# Altium schematic sheet DDR_Memory.SchDoc
size 420 x 297 mm; DrawnBy: Santiago Rodriguez; Revision: V1; SheetNumber: 6; SheetTotal: 9
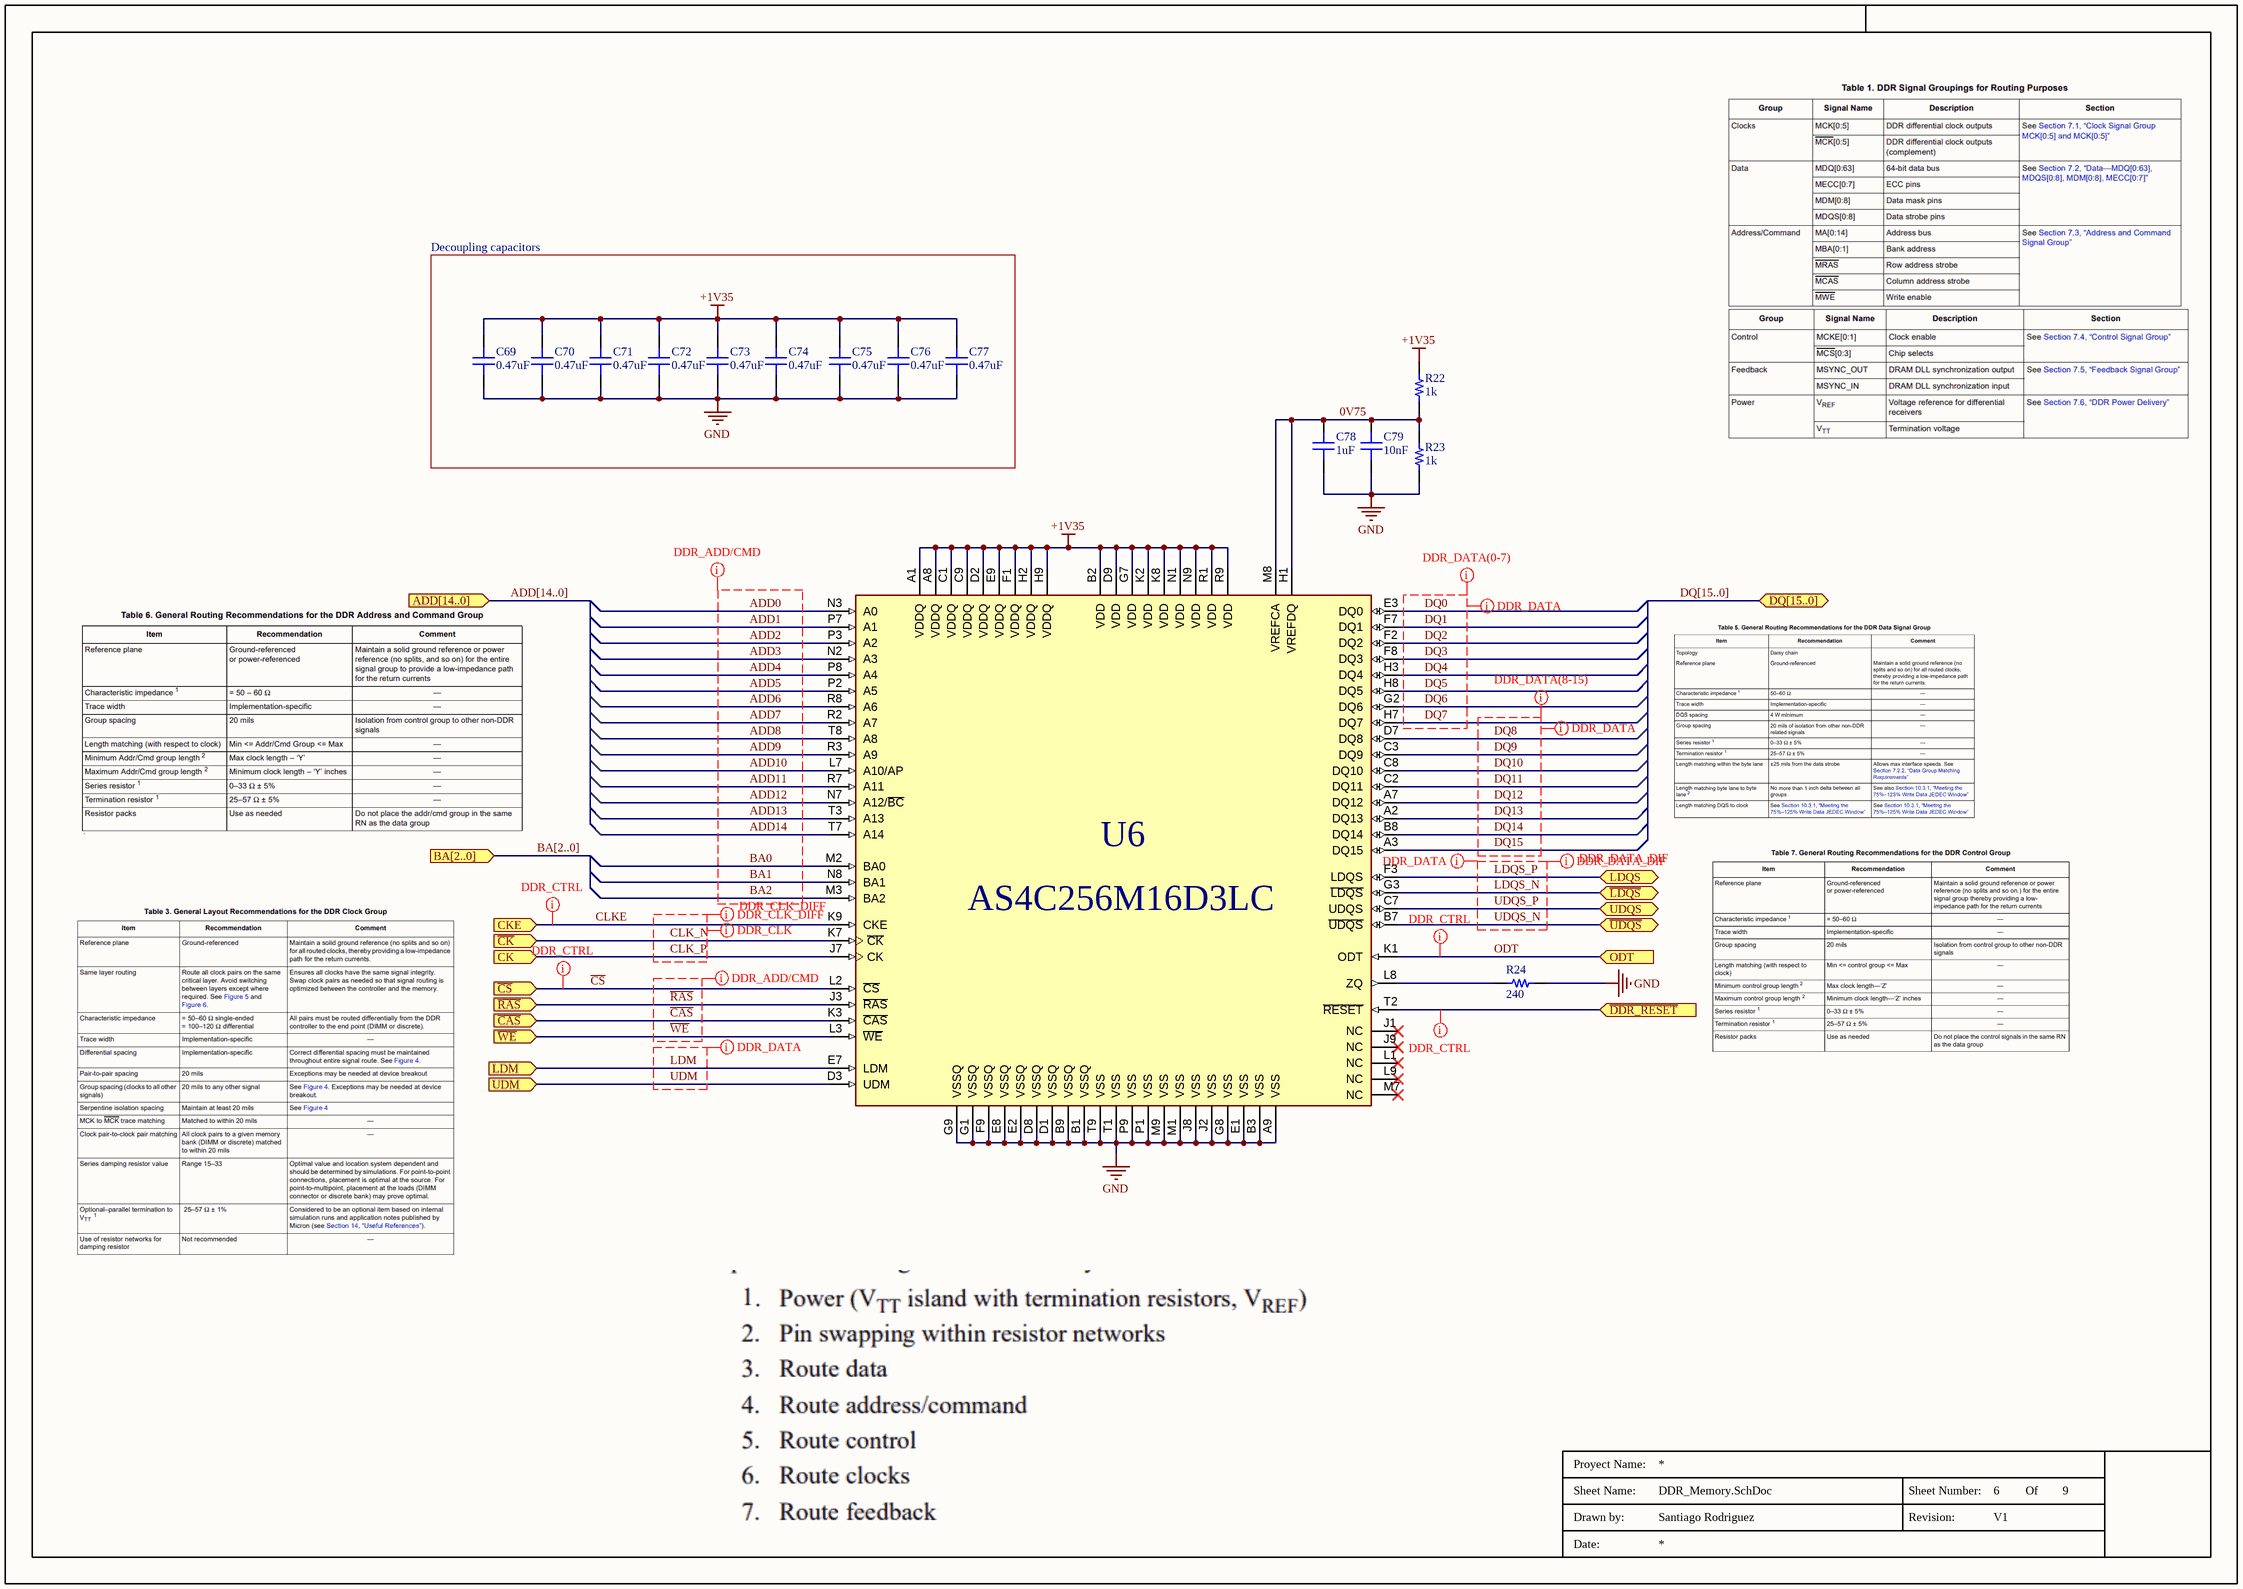
[diagram p0: DDR_Memory.SchDoc]

## Parts
C69  0.47uF  [CAP0402]
C70  0.47uF  [CAP0402]
C71  0.47uF  [CAP0402]
C72  0.47uF  [CAP0402]
C73  0.47uF  [CAP0402]
C74  0.47uF  [CAP0402]
C75  0.47uF  [CAP0402]
C76  0.47uF  [CAP0402]
C77  0.47uF  [CAP0402]
C78  1uF  [CAP0402]
C79  10nF  [CAP0402]
R22  1k  [RES0402]
R23  1k  [RES0402]
R24  240  [RES0402]
U6  AS4C256M16D3LC  [FBGA-96]

## Blocks framed on the sheet
Decoupling capacitors: C69-C77

## Ports
ADD[14..0] (in), BA[2..0] (in), CK (in), CKE (in), DQ[15..0] (bidir), LDM (in), LDQS (bidir), ODT (in), UDM (in), UDQS (bidir), ~{CAS} (in), ~{CK} (in), ~{CS} (in), ~{DDR_RESET} (in), ~{LDQS} (bidir), ~{RAS} (in), ~{UDQS} (bidir), ~{WE} (in)

## Nets
+1V35: C69.2 C70.2 C71.2 C72.2 C73.2 C74.2 C75.2 C76.2 C77.2 R22.2 U6.A1(VDDQ) U6.A8(VDDQ) U6.B2(VDD) U6.C1(VDDQ) U6.C9(VDDQ) U6.D2(VDDQ) U6.D9(VDD) U6.E9(VDDQ) U6.F1(VDDQ) U6.G7(VDD) U6.H2(VDDQ) U6.H9(VDDQ) U6.K2(VDD) U6.K8(VDD) U6.N1(VDD) U6.N9(VDD) U6.R1(VDD) U6.R9(VDD)
GND: C69.1 C70.1 C71.1 C72.1 C73.1 C74.1 C75.1 C76.1 C77.1 C78.1 C79.1 R23.1 R24.2 U6.A9(VSS) U6.B1(VSSQ) U6.B3(VSS) U6.B9(VSSQ) U6.D1(VSSQ) U6.D8(VSSQ) U6.E1(VSS) U6.E2(VSSQ) U6.E8(VSSQ) U6.F9(VSSQ) U6.G1(VSSQ) U6.G8(VSS) U6.G9(VSSQ) U6.J2(VSS) U6.J8(VSS) U6.M1(VSS) U6.M9(VSS) U6.P1(VSS) U6.P9(VSS) U6.T1(VSS) U6.T9(VSS)
0V75: C78.2 C79.2 R22.1 R23.2 U6.H1(VREFDQ) U6.M8(VREFCA)
ADD0: U6.N3(A0)
ADD1: U6.P7(A1)
ADD2: U6.P3(A2)
ADD3: U6.N2(A3)
ADD4: U6.P8(A4)
ADD5: U6.P2(A5)
ADD6: U6.R8(A6)
ADD7: U6.R2(A7)
ADD8: U6.T8(A8)
ADD9: U6.R3(A9)
ADD10: U6.L7(A10/AP)
ADD11: U6.R7(A11)
ADD12: U6.N7(A12/~{BC})
ADD13: U6.T3(A13)
ADD14: U6.T7(A14)
BA0: U6.M2(BA0)
BA1: U6.N8(BA1)
BA2: U6.M3(BA2)
~{CAS}: U6.K3(~{CAS}) ; port ~{CAS}
~{CS}: U6.L2(~{CS}) ; port ~{CS}
CLK_N: U6.K7(~{CK}) ; port ~{CK}
CLK_P: U6.J7(CK) ; port CK
CLKE: U6.K9(CKE) ; port CKE
~{DDR_RESET}: U6.T2(~{RESET}) ; port ~{DDR_RESET}
DQ0: U6.E3(DQ0)
DQ1: U6.F7(DQ1)
DQ2: U6.F2(DQ2)
DQ3: U6.F8(DQ3)
DQ4: U6.H3(DQ4)
DQ5: U6.H8(DQ5)
DQ6: U6.G2(DQ6)
DQ7: U6.H7(DQ7)
DQ8: U6.D7(DQ8)
DQ9: U6.C3(DQ9)
DQ10: U6.C8(DQ10)
DQ11: U6.C2(DQ11)
DQ12: U6.A7(DQ12)
DQ13: U6.A2(DQ13)
DQ14: U6.B8(DQ14)
DQ15: U6.A3(DQ15)
LDM: U6.E7(LDM) ; port LDM
LDQS_N: U6.G3(~{LDQS}) ; port ~{LDQS}
LDQS_P: U6.F3(LDQS) ; port LDQS
ODT: U6.K1(ODT) ; port ODT
~{RAS}: U6.J3(~{RAS}) ; port ~{RAS}
UDM: U6.D3(UDM) ; port UDM
UDQS_N: U6.B7(~{UDQS}) ; port ~{UDQS}
UDQS_P: U6.C7(UDQS) ; port UDQS
~{WE}: U6.L3(~{WE}) ; port ~{WE}
NetR24_1: R24.1 U6.L8(ZQ)

Not connected (* = marked no-connect by the designer): U6 J1(NC)* J9(NC)* L1(NC)* L9(NC)* M7(NC)*

## Buses and harness runs
bus ADD[14..0] = port ADD[14..0]
bus BA[2..0] = port BA[2..0]
bus DQ[15..0] = port DQ[15..0]

## Layout directives
net class DDR_ADD/CMD: ADD0, ADD1, ADD2, ADD3, ADD4, ADD5, ADD6, ADD7, ADD8, ADD9, ADD10, ADD11, ADD12, ADD13, ADD14, BA0, BA1, BA2, ~{CAS}, ~{RAS}, ~{WE}
differential pair; differential pair class DDR_CLK_DIFF: CLK_N, CLK_P
net class DDR_CTRL: CLKE, ODT, ~{CS}, ~{DDR_RESET}
differential pair; differential pair class DDR_DATA_DIF: LDQS_N, LDQS_P, UDQS_N, UDQS_P
net class DDR_DATA(8-15): DQ8, DQ9, DQ10, DQ11, DQ12, DQ13, DQ14, DQ15
net class DDR_DATA(0-7): DQ0, DQ1, DQ2, DQ3, DQ4, DQ5, DQ6, DQ7
net class DDR_CLK: CLK_N, CLK_P
net class DDR_DATA: DQ0, DQ1, DQ2, DQ3, DQ4, DQ5, DQ6, DQ7, DQ8, DQ9, DQ10, DQ11, DQ12, DQ13, DQ14, DQ15, LDM, LDQS_N, LDQS_P, UDM, UDQS_N, UDQS_P

## Notes on the sheet
- Proyect Name:
- Sheet Name:
- Drawn by:
- Revision:
- Sheet Number:
- Of
- Date:

## Library data of the parts
C69-C77 = C0402C474K8RAC: CAP CER 0.47uF 10V X7R 0402 10%; PartNumber: C0603C474K4RAC; Manufacturer: Kemet; ComponentLink1Description: DataSheet; ComponentLink1URL: https://content.kemet.com/datasheets/KEM_C1002_X7R_SMD.pdf; Size: 0402; ComponentLink2Description: DigiKey; ComponentLink2URL: https://www.digikey.com/en/products/filter/ceramic-capacitors/60?s=N4IgTCBcDaIMIAYAsCxyQdiQaQBwCUBBOEAXQF8g; ComponentLink3Description: ProductPage; ComponentLink3URL: https://www.kemet.com/en/us/product/C0805C474K4RACTU.html; Tolerance: 10%; Value: 0.47uF; Voltage: 10 V
C78 = C0402C105K4RAC: CAP CER 1uF 16V X7R 0402 10%; Manufacturer: Kemet; ComponentLink1Description: DataSheet; ComponentLink1URL: https://content.kemet.com/datasheets/KEM_C1002_X7R_SMD.pdf; Size: 0402; ComponentLink2Description: DigiKey; ComponentLink2URL: https://www.digikey.com/en/products/detail/kemet/C0402C105K4RAC7867/22058709?s=N4IgTCBcDaIMIAYAsCxwIwIKwGkkCUBBOEAXQF8g; Value: 1uF; Tolerance: 10%; Voltage: 16V; PartNumber: C0402C105K4RAC
C79 = C0402C103K4RAC: CAP CER 10nF 16V X7R 0402 10%; Manufactuer: Kemet; ComponentLink1Description: DataSheet; ComponentLink1URL: https://content.kemet.com/datasheets/KEM_C1002_X7R_SMD.pdf; ComponentLink2Description: DigiKey; ComponentLink2URL: https://www.digikey.com/en/products/filter/ceramic-capacitors/60?s=N4IgTCBcDaIMIAYAsCxwIwIMwGkkCUBBOEAXQF8g; Value: 10nF; Tolerance: 10%; Size: 0402; Voltage: 16V; PartNumber: C0402C103K4RAC
R22 R23 = CRCW04021K00FK: RES SMD 1K OHM 1% 0.063W 0402; Manufacturer: Vishay; ComponentLink1Description: DigiKey; ComponentLink1URL: https://www.digikey.com/en/products/filter/chip-resistor-surface-mount/52?s=N4IgTCBcDaIMICU4HUAMAWVYCMBpVqAYriALoC%20QA; ComponentLink2Description: DataSheet; ComponentLink2URL: https://www.vishay.com/docs/20035/dcrcwe3.pdf; Tolerance: 1%; Value: 1k; Size: 0402; Power: 0.063W; PartNumber: CRCW04021K00FK
R24 = CRCW0402240RFK: RES SMD 240 OHM 1% 1/10W 0402; Manufacturer: Vishay; PartNumber: CRCW0402240RFKEA; Power: 0.063W; ComponentLink1Description: DataSheet; ComponentLink1URL: https://www.vishay.com/docs/20035/dcrcwe3.pdf; ComponentLink2Description: DigiKey; ComponentLink2URL: https://www.digikey.com/en/products/detail/vishay-dale/CRCW0603240RFKEA/1174595; Value: 240; Tolerance: 1%; Size: 0402
U6 = DDR3 AS4C256M16D3LC: 256M x 16 bit DDR3L Synchronous DRAM (SDRAM); ComponentLink1Description: DataSheet; ComponentLink1URL: https://www.alliancememory.com/wp-content/uploads/pdf/ddr3/AllianceMemory_4G_DDR3L_AS4C256M16D3LC_March2020_Rev1.0.pdf